# Altium schematic sheet RFR24 AMS Design - EEPROM V1.SchDoc
size A; SheetNumber: 7; SheetTotal: 10
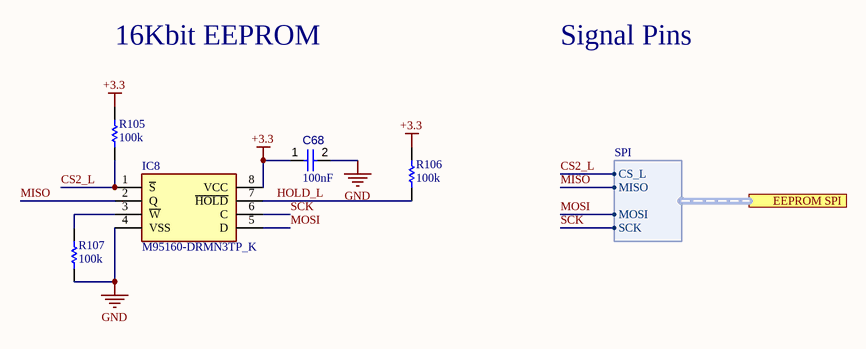
[diagram p0: RFR24 AMS Design - EEPROM V1.SchDoc]

## Parts
C68  value 100nF  [CAPC2013X145X50LL20T25]  (hidden comment: Capacitor 1 uF +/- 10% 25 V 0805)
IC8  M95160-DRMN3TP_K  [SOIC127P600X175-8N]
R105  value 100k  [RESC2013X70X40LL20T20]  (hidden comment: Resistor 1k +/-1% 0805 125 mW)
R106  value 100k  [RESC2013X70X40LL20T20]  (hidden comment: Resistor 1k +/-1% 0805 125 mW)
R107  value 100k  [RESC2013X70X40LL20T20]  (hidden comment: Resistor 1k +/-1% 0805 125 mW)

## Ports
EEPROM SPI (harness SPI)

## Harnesses
SPI: CS_L, MISO, MOSI, SCK

## Nets
+3.3: C68.1 IC8.8(VCC) R105.2 R106.2
GND: C68.2 IC8.4(VSS) R107.1
CS2_L: IC8.1(~{S}) R105.1 ; port EEPROM SPI.CS_L
HOLD_L: IC8.7(~{HOLD}) R106.1
MISO: IC8.2(Q) ; port EEPROM SPI.MISO
MOSI: IC8.5(D) ; port EEPROM SPI.MOSI
SCK: IC8.6(C) ; port EEPROM SPI.SCK
NetIC8_3: IC8.3(~{W}) R107.2

## Notes on the sheet
- 16Kbit EEPROM
- Signal Pins

## Library data of the parts
C68 = CMP-001-00010-6: Chip Capacitor, 1 uF, +/-10%, 25 V, 0805 (2012 Metric); Capacitor Type: Ceramic; Voltage Rating: 25V; RoHS Compliant: True; Pins: 2; Mounting Technology: SM; Max Operating Temperature: 125°C; Min Operating Temperature: -55°C; Tolerance: 10%; Case/Package: 0805
IC8 = M95160-DRMN3TP_K: Integrated Circuit; Manufacturer_Name: STMicroelectronics; Manufacturer_Part_Number: M95160-DRMN3TP/K; Datasheet Link: https://www.mouser.jp/datasheet/2/389/dm00066376-1797784.pdf; Height: 1.75mm; Mouser Part Number: 511-M95160-DRMN3TP/K; Mouser Price/Stock: https://www.mouser.co.uk/ProductDetail/STMicroelectronics/M95160-DRMN3TP-K?qs=4ccVDqXDOrm%252BfzFwsEAdxA%3D%3D; Arrow Part Number: M95160-DRMN3TP/K; Arrow Price/Stock: https://www.arrow.com/en/products/m95160-drmn3tpk/stmicroelectronics?region=nac
R105-R107 = CMP-009-00010-5: Chip Resistor, 1 KOhm, +/- 1%, 0.125 W, -55 to 155 degC, 0805 (2013 Metric); Power: 125mW; Voltage Rating: 150V; Tolerance: 1%; RoHS Compliant: True; Mounting Technology: SM; Pins: 2; Case/Package: 0805; Max Operating Temperature: 155°C; Min Operating Temperature: -55°C